# EAGLE design lcd (EAGLE 8.3.0)
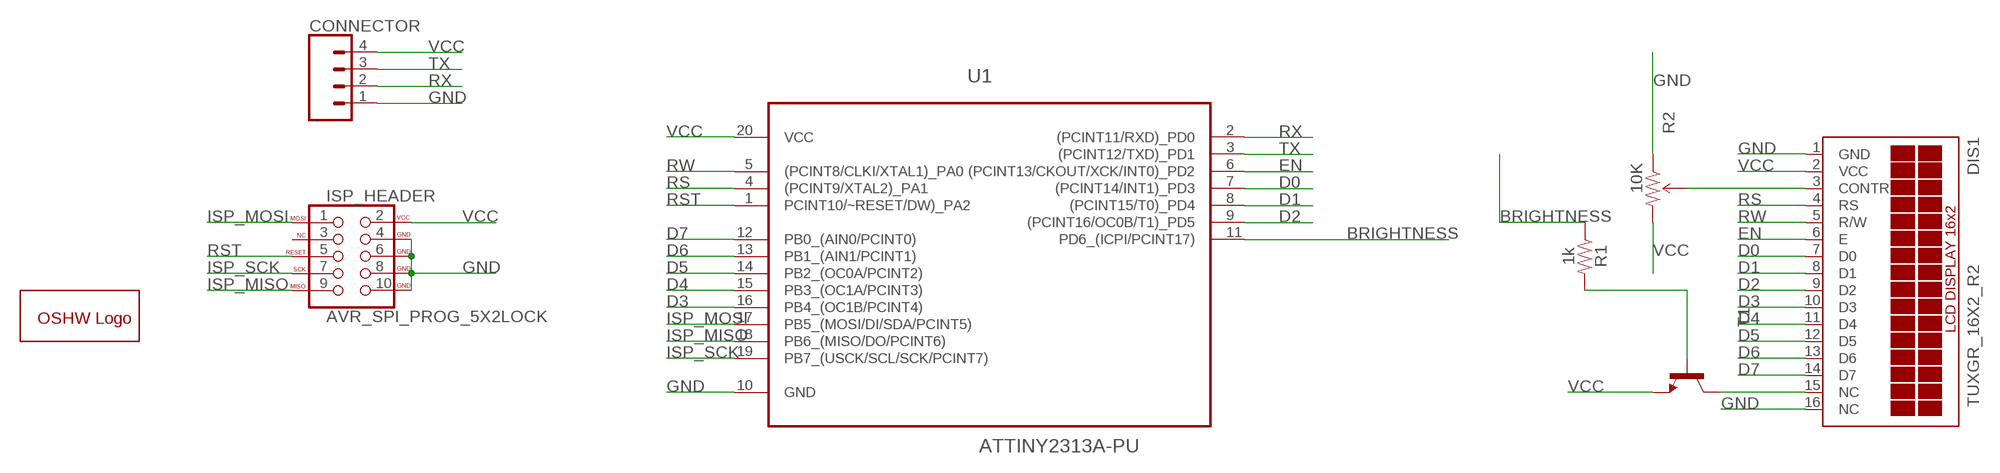
[diagram p0: schematic, sheet 1]

## Parts
CONNECTOR  CONN_04  [1X04]
DIS1  TUXGR_16X2_R2  [TUXGR_16X2_R2]
GOLD_ORB_SM2  OSHWLOGOLOGO5MM  [OSHW_5MM]
ISP_HEADER  AVR_SPI_PROG_5X2LOCK  [2X5-SHROUDED_LOCK]
R1  1k  1KOHM-HORIZ-1/4W-5%  [AXIAL-0.3]
R2  10K  TRIMPOTPTH  [TRIM_POT_PTH]
T1  -NPN-TO92-ECB  [TO92-ECB]
U1  ATTINY2313A-PU  [DIP254P762X533-20]

## Nets
BRIGHTNESS: R1.P$1 U1.11(PD6_(ICPI/PCINT17))
CONTRAST: DIS1.3(CONTR) R2.2(WIPER)
D0: DIS1.7(D0) U1.7((PCINT14/INT1)_PD3)
D1: DIS1.8(D1) U1.8((PCINT15/T0)_PD4)
D2: DIS1.9(D2) U1.9((PCINT16/OC0B/T1)_PD5)
D3: DIS1.10(D3) U1.16(PB4_(OC1B/PCINT4))
D4: DIS1.11(D4) U1.15(PB3_(OC1A/PCINT3))
D5: DIS1.12(D5) U1.14(PB2_(OC0A/PCINT2))
D6: DIS1.13(D6) U1.13(PB1_(AIN1/PCINT1))
D7: DIS1.14(D7) U1.12(PB0_(AIN0/PCINT0))
EN: DIS1.6(E) U1.6((PCINT13/CKOUT/XCK/INT0)_PD2)
GND: CONNECTOR.1 DIS1.1(GND) DIS1.16(NC) ISP_HEADER.4(GND) ISP_HEADER.6(GND) ISP_HEADER.8(GND) ISP_HEADER.10(GND) R2.1(CCW) U1.10(GND)
ISP_MISO: ISP_HEADER.9(MISO) U1.18(PB6_(MISO/DO/PCINT6))
ISP_MOSI: ISP_HEADER.1(MOSI) U1.17(PB5_(MOSI/DI/SDA/PCINT5))
ISP_SCK: ISP_HEADER.7(SCK) U1.19(PB7_(USCK/SCL/SCK/PCINT7))
N$1: DIS1.15(NC) T1.C
N$2: R1.P$2 T1.B
RS: DIS1.4(RS) U1.4((PCINT9/XTAL2)_PA1)
RST: ISP_HEADER.5(RESET) U1.1(PCINT10/~RESET/DW)_PA2)
RW: DIS1.5(R/W) U1.5((PCINT8/CLKI/XTAL1)_PA0)
RX: CONNECTOR.2 U1.2((PCINT11/RXD)_PD0)
TX: CONNECTOR.3 U1.3((PCINT12/TXD)_PD1)
VCC: CONNECTOR.4 DIS1.2(VCC) ISP_HEADER.2(VCC) R2.3(CW) T1.E U1.20(VCC)
Unconnected: ISP_HEADER.3(NC)

## Library data of the parts
CONNECTOR = SparkFun-Connectors:CONN_04: Multi connection point. Often used as Generic Header-pin footprint for 0.1 inch spaced/style header connections On any of the 0.1 inch spaced packages, you can populate with these: Break Away Headers - Straight <https://www.sparkfun.com/products/116> (PRT-00116) Break Away Male Headers - Right Angle <https://www.sparkfun.com/products/553> (PRT-00553) Female Headers <https://www.sparkfun.com/products/115> (PRT-00115) Break Away Headers - Machine Pin <https://www.sparkfun.com/products/117> (PRT-00117) Break Away Female Headers - Swiss Machine Pin <https://www.sparkfun.com/products/743> (PRT-00743) For SCREWTERMINALS and SPRING TERMINALS visit here: Screw Terimnals on SparkFun.com <https://www.sparkfun.com/search/results?term=Screw+Terminals> (5mm/3.5mm/2.54mm spacing) This device is also useful as a general connection point to wire up your design to another part of your project. Our various solder wires solder well into these plated through hole pads. Hook-Up Wire - Assortment (Stranded, 22 AWG) <https://www.sparkfun.com/products/11375> (PRT-11375) Hook-Up Wire - Assortment (Solid Core, 22 AWG) <https://www.sparkfun.com/products/11367> (PRT-11367) View the entire wire category on our website here <https://www.sparkfun.com/categories/141> Special notes: Molex polarized connector foot print use with SKU : PRT-08231 with associated crimp pins and housings. 1MM SMD Version SKU: PRT-10208; PROD_ID: CONN-09696
DIS1 = display-lcd:TUXGR_16X2_R2: Tuxgraphics LCD display 16x2 characters reflective, without background light Source: tuxgr_12x2_r2.pdf; OC_FARNELL: unknown; OC_NEWARK: unknown
GOLD_ORB_SM2 = oshw:OSHWLOGO: The OSHW logo for PCB layout
ISP_HEADER = SparkFun-Connectors:AVR_SPI_PROG_5X2: AVR 10-pin ICSP Header This is the standard AVR In Circuit Serial Programming header. Minimal, but includes pin one indicator. Works with standard Olimex programmers. SparkFun Products: 2x5 AVR ICSP Male Header <https://www.sparkfun.com/products/778> - PTH 2x5 Pin Shrouded Header <https://www.sparkfun.com/products/8506> - PTH2; PROD_ID: CONN-08671; SF_ID: PRT-08506
R1 = SparkFun-Resistors:1KOHM: 1kΩ resistor A resistor is a passive two-terminal electrical component that implements electrical resistance as a circuit element. Resistors act to reduce current flow, and, at the same time, act to lower voltage levels within circuits. - Wikipedia; PROD_ID: RES-08380
R2 = SparkFun-Retired:TRIMPOT: Various small potentiometers for "set-and-forget" applications; PROD_ID: RES-08445
T1 = transistor:*-NPN-: NPN Transistror BF959 corrected 2008.03.06
U1 = Atmel_By_element14_Batch_1-00:ATTINY2313A-PU: 8-bit Microcontroller; DESCRIPTION: 8-bit Microcontroller; MPN: ATTINY2313A-PU; OC_FARNELL: 1841616; OC_NEWARK: 12T1333; PACKAGE: DIP-20; SUPPLIER: Atmel

## Board
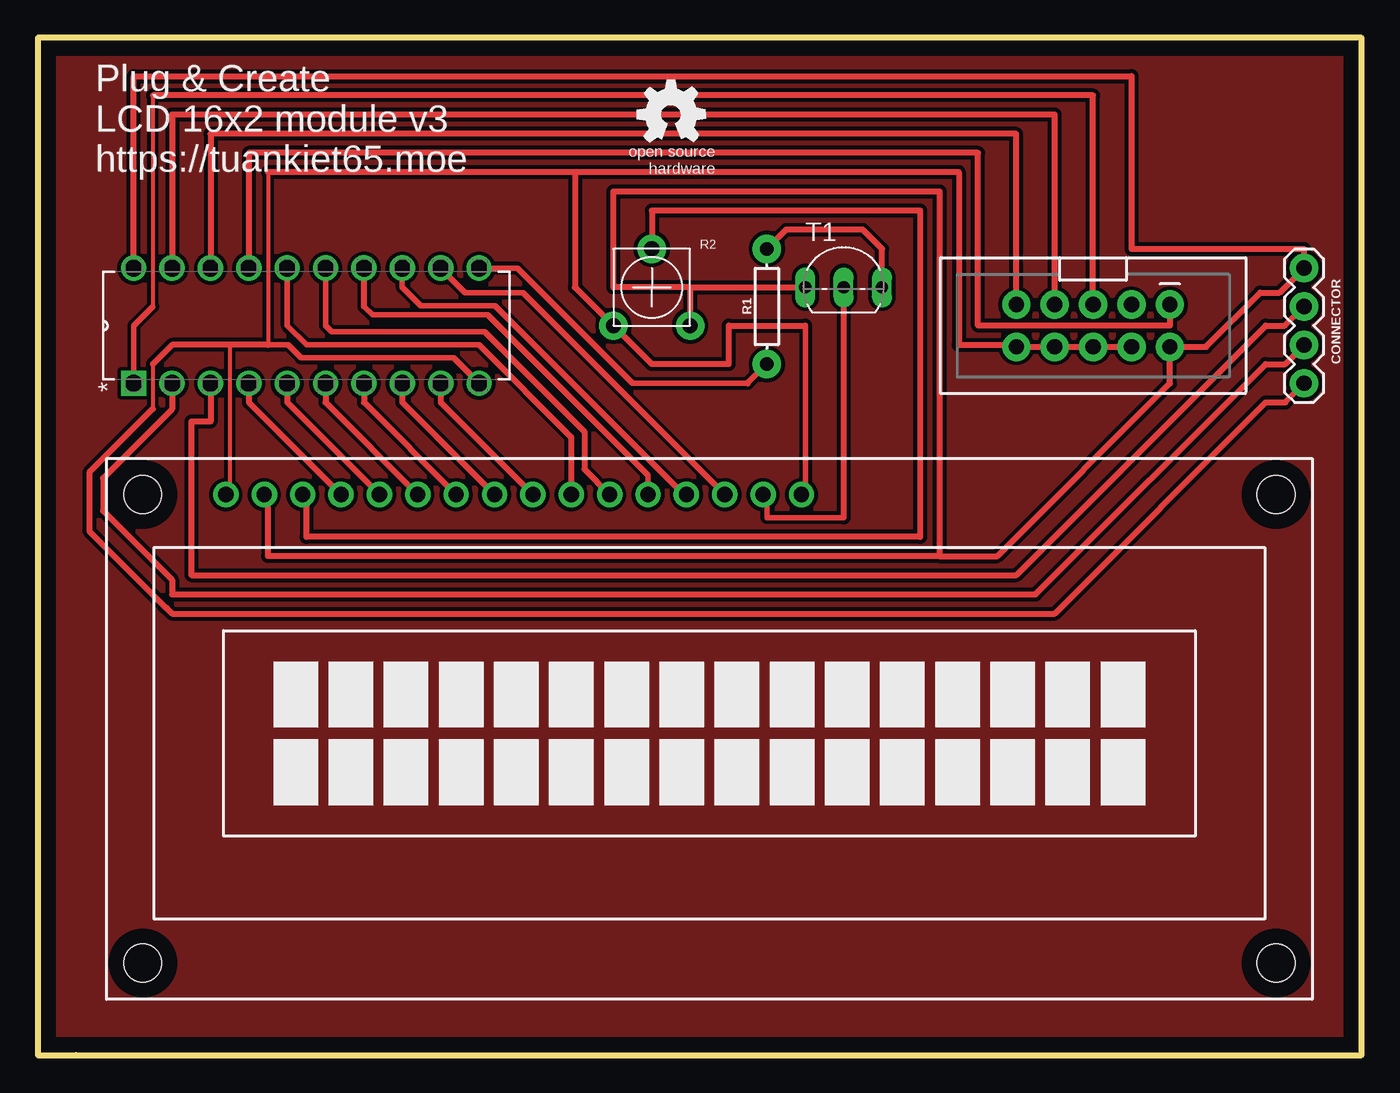
[diagram p1: board, top side]
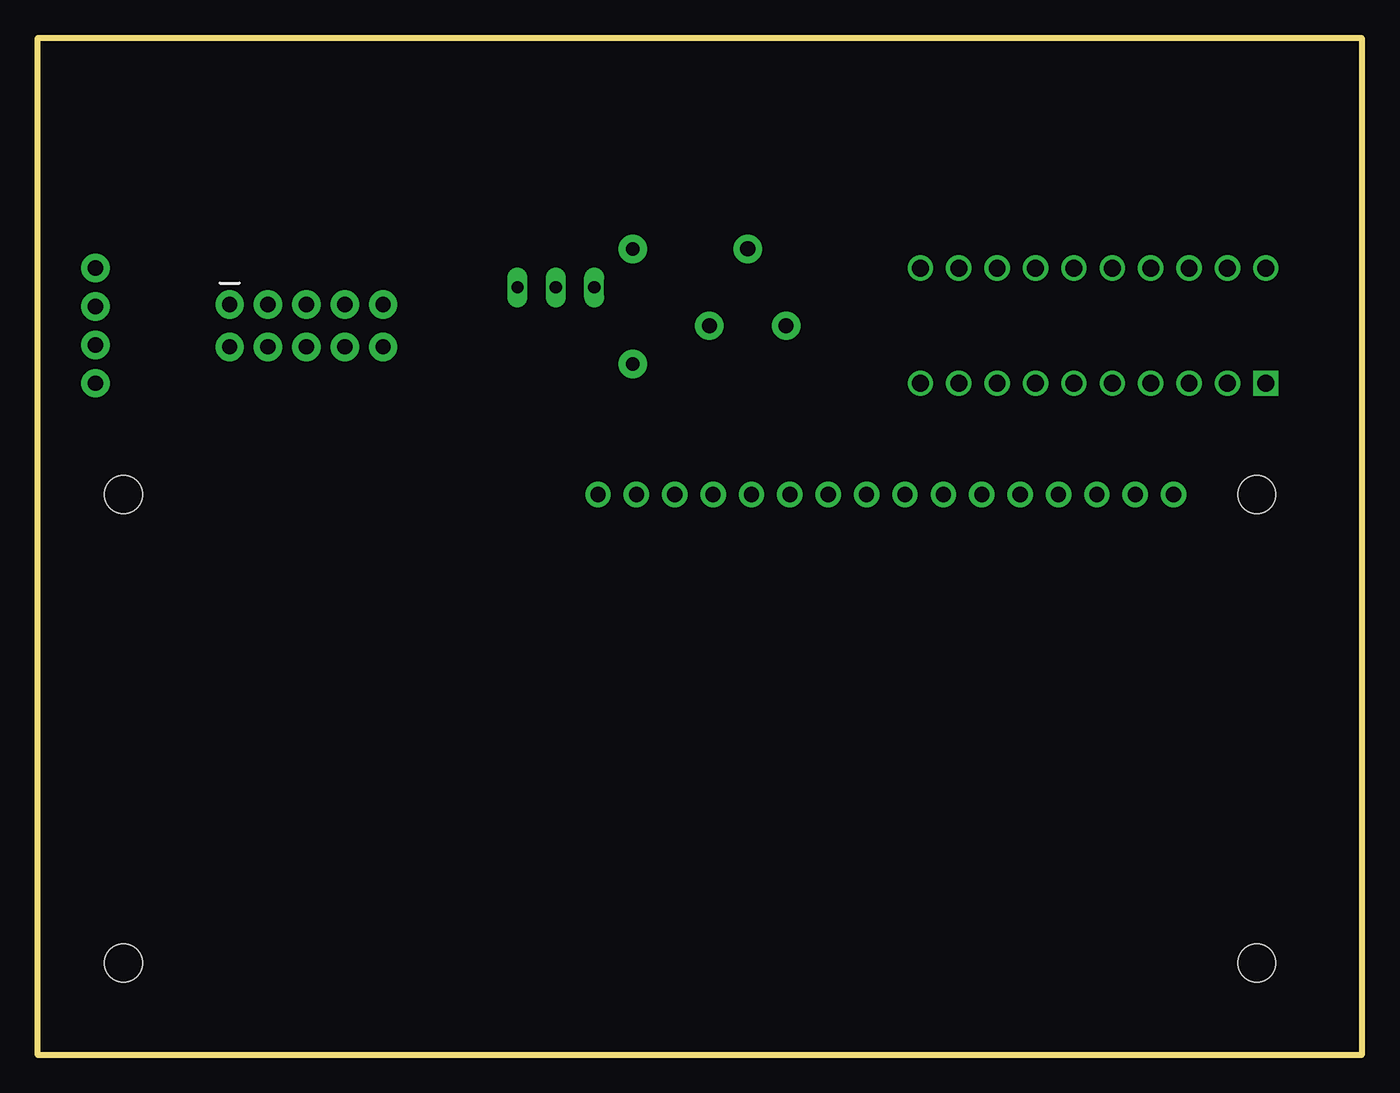
[diagram p2: board, bottom side, seen from below]

Size 87.63 x 67.31 mm. Coordinates in mm from the lower left corner, seen from the top.
Outline: 1.27,0 2.54,0
Outline: 2.54,0 0,0 0,67.31 87.63,67.31 87.63,0 2.54,0
Copper layers (1*16): Top 0.035mm / dielectric 1.5mm / Bottom 0.035mm
Design rules "default *": minimum track width 6mil, minimum drill 0.35mm, track to track 10mil, track to pad 6mil, pad to pad 6mil, via to via 6mil, smd to smd 6mil, copper to edge 40mil, drill to drill 6mil, minimum pad ring 10mil, minimum via ring 8mil, stop-mask expansion 4mil, vias tented up to drill 0mil, thermal gap 10mil

### Footprints (pad centres in the part's own frame; a part is rotated, then mirrored left to right if it is on the bottom)
1X04 = drill 1.016 pad 1.88: 1 0,0; 2 2.54,0; 3 5.08,0; 4 7.62,0
TUXGR_16X2_R2 = drill 1 pad 1.676: 1 -32,15.5; 2 -29.46,15.5; 3 -26.92,15.5; 4 -24.38,15.5; 5 -21.84,15.5; 6 -19.3,15.5; 7 -16.76,15.5; 8 -14.22,15.5; 9 -11.68,15.5; 10 -9.14,15.5; 11 -6.6,15.5; 12 -4.06,15.5; 13 -1.52,15.5; 14 1.02,15.5; 15 3.56,15.5; 16 6.1,15.5 | hole 2.5: -37.5,-15.5; 37.5,-15.5; -37.5,15.5; 37.5,15.5
2X5-SHROUDED_LOCK = drill 1.016 pad 1.88: 1 -1.397,5.08; 2 1.397,5.08; 3 -1.397,2.54; 4 1.397,2.54; 5 -1.397,0; 6 1.397,0; 7 -1.397,-2.54; 8 1.397,-2.54; 9 -1.397,-5.08; 10 1.397,-5.08
AXIAL-0.3 = drill 0.9 pad 1.88: P$1 -3.81,0; P$2 3.81,0
TRIM_POT_PTH = drill 1 pad 1.88: 1 -2.54,-2.54; 2 0,2.54; 3 2.54,-2.54
TO92-ECB = drill 0.813 long: B 2.54,0; C 0,0; E -2.54,0
DIP254P762X533-20 = drill 1.118 square: 1 -7.62,22.86 | drill 1.118: 2 -7.62,20.32; 3 -7.62,17.78; 4 -7.62,15.24; 5 -7.62,12.7; 6 -7.62,10.16; 7 -7.62,7.62; 8 -7.62,5.08; 9 -7.62,2.54; 10 -7.62,0; 11 0,0; 12 0,2.54; 13 0,5.08; 14 0,7.62; 15 0,10.16; 16 0,12.7; 17 0,15.24; 18 0,17.78; 19 0,20.32; 20 0,22.86

### Placement (x,y rotation side)
CONNECTOR  83.82,44.45 90 top
DIS1  44.45,21.59 0 top
GOLD_ORB_SM2  41.91,62.23 0 top
ISP_HEADER  69.85,48.26 270 top
R1  48.26,49.53 90 top
R2  40.64,50.8 0 top
T1  53.34,50.8 0 top
U1  29.21,52.07 90 top

### Tracks (layer width: path | path; a pad name or v marks a point on that pad's centre or on a via)
BRIGHTNESS
  Top 0.356: 46.99,44.45 39.37,44.45 31.75,52.07 U1.11
  Top 0.381: 46.99,44.45 R1.P$1
CONTRAST
  Top 0.381: 17.78,34.29 17.78,36.84 DIS1.3
  Top 0.406: 17.78,34.29 58.42,34.29 58.42,55.88 40.64,55.88 R2.2
D0
  Top 0.381: 21.59,43.19 DIS1.7
  Top 0.406: U1.7 21.59,43.19
D1
  Top 0.381: 24.13,43.19 DIS1.8
  Top 0.406: U1.8 24.13,43.19
D2
  Top 0.381: 26.67,43.19 DIS1.9
  Top 0.406: U1.9 26.67,43.19
D3
  Top 0.356: 35.31,40.89 29.21,46.99 17.78,46.99 16.51,48.26 U1.16
  Top 0.381: 35.31,40.89 DIS1.10
D4
  Top 0.356: 36.17,41.25 29.57,47.85 19.46,47.85 19.05,48.26 U1.15
  Top 0.381: 36.17,41.25 36.17,38.77 DIS1.11
D5
  Top 0.356: DIS1.12 40.39,38.35 29.77,48.97 22.15,48.97 21.59,49.53
  Top 0.381: 21.59,49.53 U1.14
D6
  Top 0.356: U1.13 24.13,50.8 25.35,49.58 30.28,49.58 42.77,37.09 DIS1.13
D7
  Top 0.356: U1.12 28.3,50.44 32.12,50.44 DIS1.14
EN
  Top 0.381: 19.05,43.19 DIS1.6
  Top 0.406: U1.6 19.05,43.19
GND
  Top 0.254: 7.62,45.72 7.62,42.76 | 15.24,58.42 15.24,47.04 15.29,46.99 | 12.7,46.99 12.7,37.34 DIS1.1
  Top 0.356: 15.24,46.99 15.29,46.99 16.56,46.99 17.42,46.13 27.53,46.13 U1.10 | 50.8,48.26 50.8,37.34 DIS1.16
  Top 0.406: 7.62,45.72 8.89,46.99 12.7,46.99 15.24,46.99 | CONNECTOR.1 83.82,44.43 82.57,43.18 81.28,43.18 67.31,29.21 8.89,29.21 8.53,29.57 8.51,29.57 3.42,34.66 3.42,38.55 7.62,42.76 | 50.8,48.26 45.72,48.26 45.72,45.72 40.64,45.72 R2.1 35.56,50.8 35.56,58.42 | 35.56,58.42 60.96,58.42 60.96,46.99 64.77,46.99 ISP_HEADER.10 ISP_HEADER.8 ISP_HEADER.6 ISP_HEADER.4 | 35.56,58.42 15.24,58.42
ISP_MISO
  Top 0.406: ISP_HEADER.9 64.77,60.96 11.43,60.96 U1.18
ISP_MOSI
  Top 0.406: ISP_HEADER.1 74.93,48.26 62.23,48.26 62.23,59.69 13.97,59.69 U1.17
ISP_SCK
  Top 0.406: ISP_HEADER.7 67.31,62.23 8.89,62.23 U1.19
N$1
  Top 0.356: 53.34,35.56 48.26,35.56 48.26,36.84 DIS1.15
  Top 0.406: T1.C 53.34,35.56
N$2
  Top 0.381: 55.88,53.34 54.61,54.61 49.53,54.61 R1.P$2
  Top 0.406: T1.B 55.88,53.34
N$3
  pour Top: 0,67.31 87.63,67.31 87.63,0 0,0
RS
  Top 0.381: 13.97,43.19 DIS1.4
  Top 0.406: U1.4 13.97,43.19
RST
  Top 0.254: 7.62,63.5 7.62,49.53
  Top 0.356: 7.62,49.53 6.35,48.26 U1.1
  Top 0.406: ISP_HEADER.5 69.85,63.5 7.62,63.5
RW
  Top 0.381: 16.51,43.19 DIS1.5
  Top 0.406: U1.5 16.51,43.19
RX
  Top 0.406: U1.2 8.89,42.73 4.33,38.17 4.33,36 8.89,31.45 8.89,30.48 66.04,30.48 81.28,45.72 82.57,45.72 83.82,46.97 CONNECTOR.2
TX
  Top 0.406: U1.3 11.43,41.91 10.16,41.91 10.16,31.75 64.77,31.75 81.28,48.26 82.55,48.26 CONNECTOR.3
VCC
  Top 0.381: 15.24,33.02 15.24,36.84 DIS1.2
  Top 0.406: 43.18,50.8 38.1,50.8 38.1,57.15 59.69,57.15 59.69,33.02 | 43.18,50.8 R2.3 | 43.18,50.8 T1.E | U1.20 6.35,64.77 72.39,64.77 72.39,53.34 83.82,53.34 CONNECTOR.4 82.19,50.44 80.9,50.44 77.32,46.86 ISP_HEADER.2 74.93,44.45 63.5,33.02 59.69,33.02 | 59.69,33.02 15.24,33.02

### Text on the board
tPlace: Plug & Create / LCD 16x2 module v3 / https://tuankiet65.moe